# Altium schematic sheet sche1.SchDoc
size A
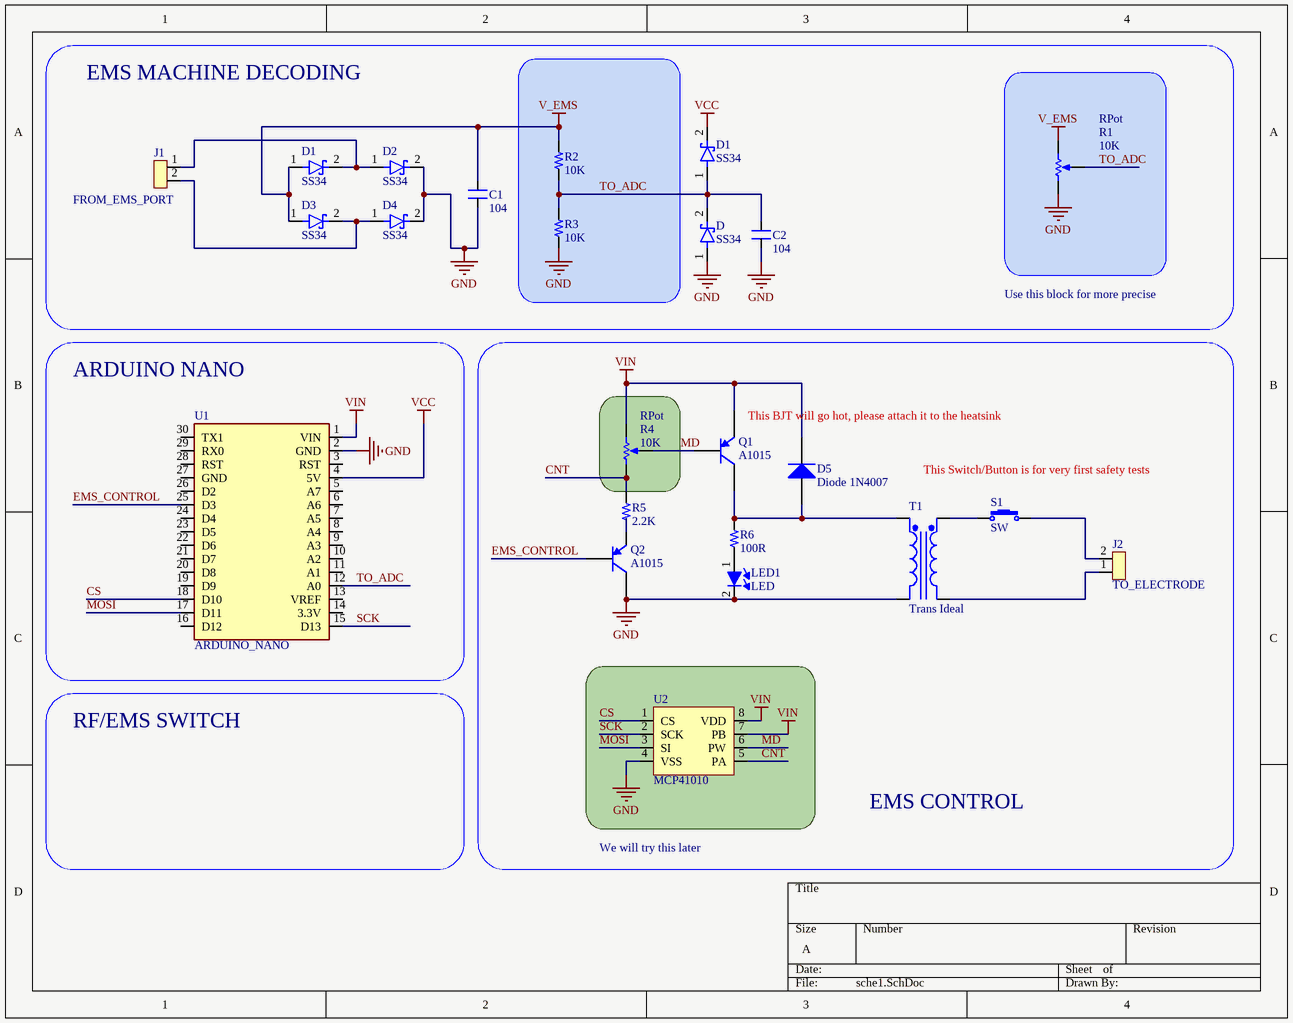
[diagram p0: sche1.SchDoc]

## Parts
(Parts that share a designator on the sheet are numbered #1, #2 ... from top to bottom, then left to right.)
C1  104  [SMD_RC_0201]
C2  104  [SMD_RC_0201]
D  SS34  [DIOM7959X265N]
D1#1  SS34  [DIOM7959X265N]
D1#2  SS34  [DIOM7959X265N]
D2  SS34  [DIOM7959X265N]
D3  SS34  [DIOM7959X265N]
D4  SS34  [DIOM7959X265N]
D5  Diode 1N4007  [DO-41]
J1  FROM_EMS_PORT
J2  TO_ELECTRODE
LED1  LED  [SMD_LED_0805]
Q1  A1015  [SOT-23B_L]
Q2  A1015  [SOT-23B_L]
R1  RPot  value 10K  [VR5]
R2  10K  [SMD_RC_0201]
R3  10K  [SMD_RC_0201]
R4  RPot  value 10K  [VR5]
R5  2.2K  [SMD_RC_0201]
R6  100R  [SMD_RC_0201]
S1  SW  [SW_SMD_1]
T1  Trans Ideal  [TRF_4]
U1  ARDUINO_NANO
U2  MCP41010

## Blocks framed on the sheet
EMS MACHINE DECODING: C1 C2 D D1#1 D1#2 D2-D4 J1 R1-R3
ARDUINO NANO: U1
EMS CONTROL: D5 J2 LED1 Q1 Q2 R4-R6 S1 T1 U2

## Nets
GND: C1.1 C2.1 D.1(A) D2.2(K) D4.2(K) LED1.2 Q2.1(C) R1.1(TOP) R3.1 T1.2(Pri-) U1.2(GND) U2.4(VSS)
V_EMS: C1.2 D1#2.1(A) D3.1(A) R1.2(BOT) R2.1
VCC: D1#1.2(K) U1.4(5V)
VIN: D5.2(K) Q1.3(E) R4.2(BOT) U1.1(VIN) U2.7(PB) U2.8(VDD)
CNT: R4.1(TOP) R5.2 U2.5(PA)
CS: U1.18(D10) U2.1(CS)
EMS_CONTROL: Q2.2(B) U1.25(D3)
MD: Q1.2(B) R4.3(TAP) U2.6(PW)
MOSI: U1.17(D11) U2.3(SI)
SCK: U1.15(D13) U2.2(SCK)
TO_ADC: C2.2 D.2(K) D1#1.1(A) R1.3(TAP) R2.2 R3.2 U1.12(A0)
NetD1#2_2: D1#2.2(K) D2.1(A) J1.1
NetD3_2: D3.2(K) D4.1(A) J1.2
NetD5_1: D5.1(A) Q1.1(C) R6.2 T1.1(Pri+)
NetJ2_1: J2.1 T1.4(Sec-)
NetJ2_2: J2.2 S1.2
NetLED1_1: LED1.1 R6.1
NetQ2_3: Q2.3(E) R5.1
NetS1_1: S1.1 T1.3(Sec+)

Not connected (* = marked no-connect by the designer): U1 3(RST) 5(A7) 6(A6) 7(A5) 8(A4) 9(A3) 10(A2) 11(A1) 13(VREF) 14(3.3V) 16(D12) 19(D9) 20(D8) 21(D7) 22(D6) 23(D5) 24(D4) 26(D2) 27(GND) 28(RST) 29(RX0) 30(TX1)

## Notes on the sheet
- Use this block for more precise
- (near Q1) This BJT will go hot, please attach it to the heatsink
- This Switch/Button is for very first safety tests
- RF/EMS SWITCH
- We will try this later

## Library data of the parts
C1 C2 = C
D D1#1 D1#2 D2-D4 = SS34: Diode Schottky 40V 3A Surface Mount SMC _DO-214AB_; MF: ON Semiconductor; SnapEDA_Link: https://www.snapeda.com/parts/SS34/ON%20Semiconductor/view-part/4631325/?ref=snap; MP: SS34; Availability: Unavailable; Price: None; Value: *; Package: DO-214AB-214 ON Semiconductor
D5 = Diode 1N4007: 1 Amp General Purpose Rectifier; Published: 8-Jun-2000; LatestRevisionDate: 17-Jul-2002; LatestRevisionNote: Re-released for DXP Platform.; DatasheetVersion: 1998; PackageVersion: Aug-1999; PackageReference: DO-41; Publisher: Altium Limited; PackageDescription: Diode, Axial; Body 5.2 x 2.7 mm (LxDia. max), Lead Dia. 0.86 mm (max); Code_JEDEC: DO-204-AL; ComponentLink1Description: Manufacturer Link; ComponentLink1URL: http://www.fairchildsemi.com/; ComponentLink2Description: Datasheet; ComponentLink2URL: http://www.fairchildsemi.com/ds/1N%2F1N4001.pdf
J1 J2 = HEADER_2
Q1 Q2 = PNP: PNP Bipolar Transistor; Published: 8-Jun-2000; LatestRevisionDate: 29-May-2009; LatestRevisionNote: IPC-7351 Footprint Added.; PackageVersion: Aug-1999; PackageReference: SOT-23B; Publisher: Altium Limited; PackageDescription: 3-Pin SOT-23 Package 0.95 mm Pitch, 2.4 mm Lead Span
R1 R4 = RPot: Potentiometer; Sim Note: Enter the Resistance value and the set point into parameter fields.; Set Position: 0.5; Published: 8-Jun-2000; LatestRevisionDate: 17-Jul-2002; LatestRevisionNote: Re-released for DXP Platform.; PackageReference: VR5; Publisher: Altium Limited; PackageDescription: Variable Resistor, Thru-Hole; 3 Leads
R2 R3 R5 R6 = R
T1 = Trans Ideal: Transformer (Ideal); Published: 8-Jun-2000; LatestRevisionDate: 17-Jul-2002; LatestRevisionNote: Re-released for DXP Platform.; PackageReference: TRF_4; Publisher: Altium Limited; PackageDescription: Transformer; 4 Leads
S1 = SW: ComponentLink1Description: TheGioiIC; ComponentLink1URL: https://thegioiic.com/products/nut-nhan-3x4-cao-2-5mm-2pin-smd